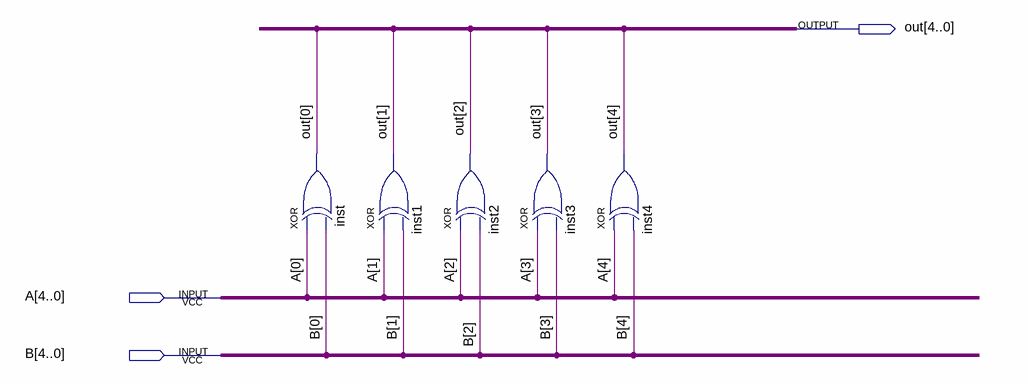
[diagram p0: schematic sheet]
// Quartus schematic CircuitoXOR.bdf as structural Verilog: 5 symbols, 3 pins
module CircuitoXOR (
  input  [4:0] A,
  input  [4:0] B,
  output [4:0] out
);

  xor inst (out[0], A[0], B[0]);
  xor inst1 (out[1], A[1], B[1]);
  xor inst2 (out[2], A[2], B[2]);
  xor inst3 (out[3], A[3], B[3]);
  xor inst4 (out[4], A[4], B[4]);
endmodule
